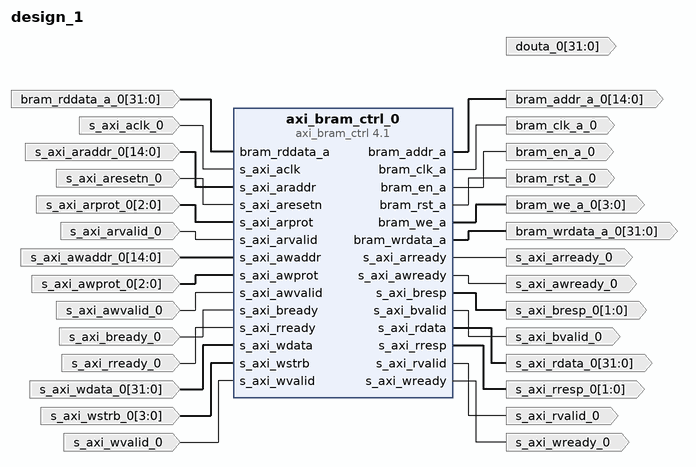
[diagram p0: block diagram of the top level]
# Vivado block design design_1, xc7z010clg400-1, Vivado 2023.1
create_bd_design design_1

create_bd_port -dir I -from 14 -to 0 s_axi_araddr_0
create_bd_port -dir I -from 2 -to 0 s_axi_arprot_0
create_bd_port -dir O s_axi_arready_0
create_bd_port -dir I s_axi_arvalid_0
create_bd_port -dir I -from 14 -to 0 s_axi_awaddr_0
create_bd_port -dir I -from 2 -to 0 s_axi_awprot_0
create_bd_port -dir O s_axi_awready_0
create_bd_port -dir I s_axi_awvalid_0
create_bd_port -dir I s_axi_bready_0
create_bd_port -dir O -from 1 -to 0 s_axi_bresp_0
create_bd_port -dir O s_axi_bvalid_0
create_bd_port -dir O -from 31 -to 0 s_axi_rdata_0
create_bd_port -dir I s_axi_rready_0
create_bd_port -dir O -from 1 -to 0 s_axi_rresp_0
create_bd_port -dir O s_axi_rvalid_0
create_bd_port -dir I -from 31 -to 0 s_axi_wdata_0
create_bd_port -dir O s_axi_wready_0
create_bd_port -dir I -from 3 -to 0 s_axi_wstrb_0
create_bd_port -dir I s_axi_wvalid_0
create_bd_port -dir I -type clk s_axi_aclk_0
create_bd_port -dir I -type rst s_axi_aresetn_0
create_bd_port -dir O -from 31 -to 0 douta_0
create_bd_port -dir O -from 14 -to 0 bram_addr_a_0
create_bd_port -dir O -type clk bram_clk_a_0
create_bd_port -dir O -from 31 -to 0 bram_wrdata_a_0
create_bd_port -dir I -from 31 -to 0 bram_rddata_a_0
create_bd_port -dir O bram_en_a_0
create_bd_port -dir O -type rst bram_rst_a_0
create_bd_port -dir O -from 3 -to 0 bram_we_a_0

create_bd_cell -type ip -vlnv xilinx.com:ip:axi_bram_ctrl:4.1 axi_bram_ctrl_0
set_property -dict {CONFIG.PROTOCOL AXI4LITE CONFIG.SINGLE_PORT_BRAM 1} [get_bd_cells axi_bram_ctrl_0]

# ---- connections ----

connect_bd_net [get_bd_pins axi_bram_ctrl_0/bram_addr_a] [get_bd_ports bram_addr_a_0]
connect_bd_net [get_bd_pins axi_bram_ctrl_0/bram_clk_a] [get_bd_ports bram_clk_a_0]
connect_bd_net [get_bd_pins axi_bram_ctrl_0/bram_en_a] [get_bd_ports bram_en_a_0]
connect_bd_net [get_bd_pins axi_bram_ctrl_0/bram_rst_a] [get_bd_ports bram_rst_a_0]
connect_bd_net [get_bd_pins axi_bram_ctrl_0/bram_we_a] [get_bd_ports bram_we_a_0]
connect_bd_net [get_bd_pins axi_bram_ctrl_0/bram_wrdata_a] [get_bd_ports bram_wrdata_a_0]
connect_bd_net [get_bd_pins axi_bram_ctrl_0/s_axi_arready] [get_bd_ports s_axi_arready_0]
connect_bd_net [get_bd_pins axi_bram_ctrl_0/s_axi_awready] [get_bd_ports s_axi_awready_0]
connect_bd_net [get_bd_pins axi_bram_ctrl_0/s_axi_bresp] [get_bd_ports s_axi_bresp_0]
connect_bd_net [get_bd_pins axi_bram_ctrl_0/s_axi_bvalid] [get_bd_ports s_axi_bvalid_0]
connect_bd_net [get_bd_pins axi_bram_ctrl_0/s_axi_rdata] [get_bd_ports s_axi_rdata_0]
connect_bd_net [get_bd_pins axi_bram_ctrl_0/s_axi_rresp] [get_bd_ports s_axi_rresp_0]
connect_bd_net [get_bd_pins axi_bram_ctrl_0/s_axi_rvalid] [get_bd_ports s_axi_rvalid_0]
connect_bd_net [get_bd_pins axi_bram_ctrl_0/s_axi_wready] [get_bd_ports s_axi_wready_0]
connect_bd_net -net bram_rddata_a_0_1 [get_bd_ports bram_rddata_a_0] [get_bd_pins axi_bram_ctrl_0/bram_rddata_a]
connect_bd_net -net s_axi_aclk_0_1 [get_bd_ports s_axi_aclk_0] [get_bd_pins axi_bram_ctrl_0/s_axi_aclk]
connect_bd_net -net s_axi_araddr_0_1 [get_bd_ports s_axi_araddr_0] [get_bd_pins axi_bram_ctrl_0/s_axi_araddr]
connect_bd_net -net s_axi_aresetn_0_1 [get_bd_ports s_axi_aresetn_0] [get_bd_pins axi_bram_ctrl_0/s_axi_aresetn]
connect_bd_net -net s_axi_arprot_0_1 [get_bd_ports s_axi_arprot_0] [get_bd_pins axi_bram_ctrl_0/s_axi_arprot]
connect_bd_net -net s_axi_arvalid_0_1 [get_bd_ports s_axi_arvalid_0] [get_bd_pins axi_bram_ctrl_0/s_axi_arvalid]
connect_bd_net -net s_axi_awaddr_0_1 [get_bd_ports s_axi_awaddr_0] [get_bd_pins axi_bram_ctrl_0/s_axi_awaddr]
connect_bd_net -net s_axi_awprot_0_1 [get_bd_ports s_axi_awprot_0] [get_bd_pins axi_bram_ctrl_0/s_axi_awprot]
connect_bd_net -net s_axi_awvalid_0_1 [get_bd_ports s_axi_awvalid_0] [get_bd_pins axi_bram_ctrl_0/s_axi_awvalid]
connect_bd_net -net s_axi_bready_0_1 [get_bd_ports s_axi_bready_0] [get_bd_pins axi_bram_ctrl_0/s_axi_bready]
connect_bd_net -net s_axi_rready_0_1 [get_bd_ports s_axi_rready_0] [get_bd_pins axi_bram_ctrl_0/s_axi_rready]
connect_bd_net -net s_axi_wdata_0_1 [get_bd_ports s_axi_wdata_0] [get_bd_pins axi_bram_ctrl_0/s_axi_wdata]
connect_bd_net -net s_axi_wstrb_0_1 [get_bd_ports s_axi_wstrb_0] [get_bd_pins axi_bram_ctrl_0/s_axi_wstrb]
connect_bd_net -net s_axi_wvalid_0_1 [get_bd_ports s_axi_wvalid_0] [get_bd_pins axi_bram_ctrl_0/s_axi_wvalid]

validate_bd_design
save_bd_design
